# Altium schematic sheet RST.SchDoc
size A4
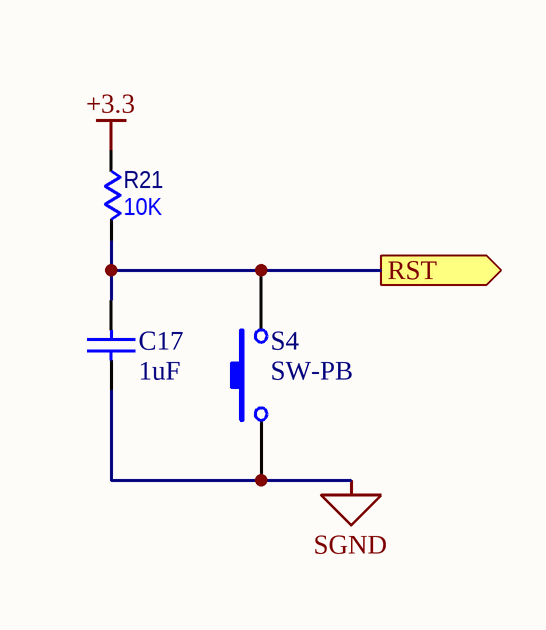
[diagram p0: RST.SchDoc]

## Parts
C17  value 1uF  [0603]  (hidden comment: Cap)
R21  value 10K  [0603]  (hidden comment: Res)
S4  SW-PB  [SW_PB2_A1]

## Ports
RST (out)

## Nets
+3.3: R21.1
SGND: C17.1 S4.1
RST: C17.2 R21.2 S4.2 ; port RST

## Library data of the parts
C17 = Cap: 无极性电容; Published: 8-Jun-2000; LatestRevisionDate: 17-Jul-2002; LatestRevisionNote: Re-released for DXP Platform.; PackageReference: RAD-0.3; Publisher: Altium Limited
R21 = Res: 常规电阻
S4 = SW-PB: 微动开关; Published: 24-Mar-1999; LatestRevisionDate: 17-Jul-2002; LatestRevisionNote: Re-released for DXP Platform.; PackageReference: SPST-2; Publisher: Altium Limited